# Altium schematic sheet UsbGameController.SchDoc
size OrCAD A
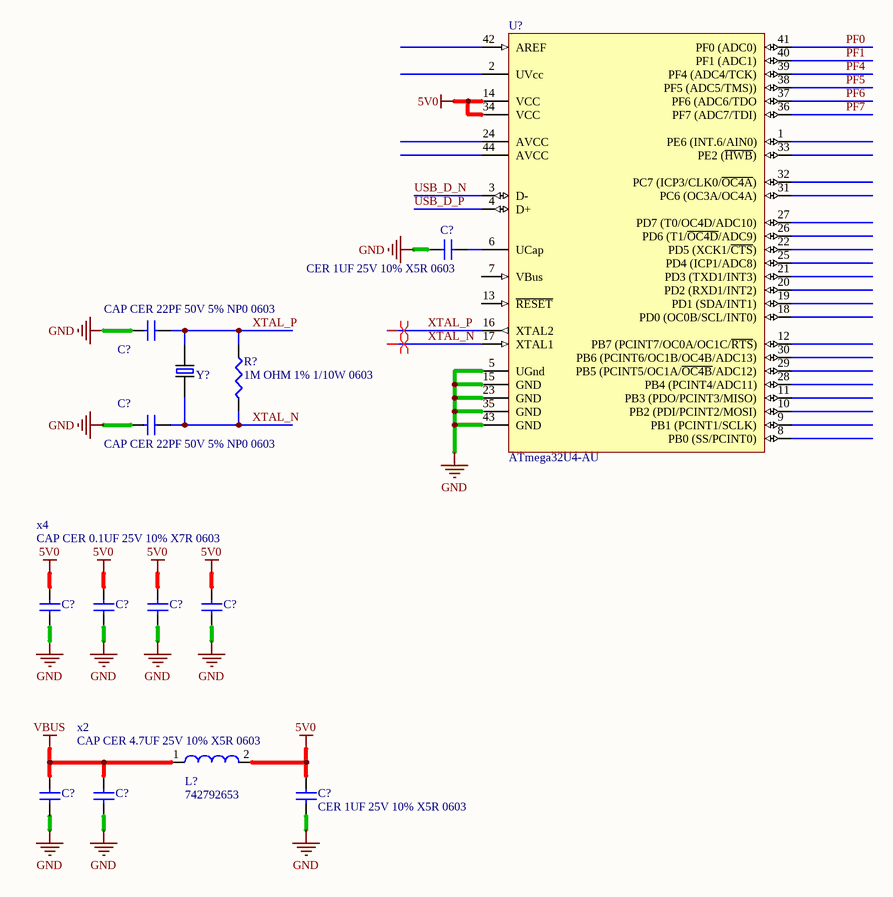
[diagram p0: UsbGameController.SchDoc]

## Parts
(Parts that share a designator on the sheet are numbered #1, #2 ... from top to bottom, then left to right.)
C?#1  CER 1UF 25V 10% X5R 0603  [C0603]
C?#2  CAP CER 22PF 50V 5% NP0 0603  [C0603]
C?#3  CAP CER 22PF 50V 5% NP0 0603  [C0603]
C?#4  CAP CER 0.1UF 25V 10% X7R 0603  [C0603]
C?#5  CAP CER 0.1UF 25V 10% X7R 0603  [C0603]  (value not drawn)
C?#6  CAP CER 0.1UF 25V 10% X7R 0603  [C0603]  (value not drawn)
C?#7  CAP CER 0.1UF 25V 10% X7R 0603  [C0603]  (value not drawn)
C?#8  CAP CER 4.7UF 25V 10% X5R 0603  [C0603]
C?#9  CAP CER 4.7UF 25V 10% X5R 0603  [C0603]  (value not drawn)
C?#10  CER 1UF 25V 10% X5R 0603  [C0603]
L?  742792653  [SMD-0603]
R?  1M OHM 1% 1/10W 0603  [R0603]
U?  ATmega32U4-AU  [44ML_N]
Y?  CRYSTAL 16.0000MHZ 10PF SMD  [4-SMD]  (value not drawn)

## Nets
5V0: C?#4.1 C?#5.1 C?#6.1 C?#7.1 C?#10.1 L?.2 U?.14(VCC) U?.34(VCC)
GND: C?#1.2 C?#2.1 C?#3.1 C?#4.2 C?#5.2 C?#6.2 C?#7.2 C?#8.2 C?#9.2 C?#10.2 U?.5(UGnd) U?.15(GND) U?.23(GND) U?.35(GND) U?.43(GND)
VBUS: C?#8.1 C?#9.1 L?.1
PF0: U?.41(PF0_(ADC0))
PF1: U?.40(PF1_(ADC1))
PF4: U?.39(PF4_(ADC4/TCK))
PF5: U?.38(PF5_(ADC5/TMS)))
PF6: U?.37(PF6_(ADC6/TDO)
PF7: U?.36(PF7_(ADC7/TDI))
USB_D_N: U?.3(D-)
USB_D_P: U?.4(D+)
XTAL_N: C?#3.2 R?.1 U?.17(XTAL1) Y?.+
XTAL_P: C?#2.2 R?.2 U?.16(XTAL2) Y?.-
NetC?#1_1: C?#1.1 U?.6(UCap)

Not connected (* = marked no-connect by the designer): U? 1(PE6_(INT.6/AIN0)) 2(UVcc) 7(VBus) 8(PB0_(SS/PCINT0)) 9(PB1_(PCINT1/SCLK)) 10(PB2_(PDI/PCINT2/MOSI)) 11(PB3_(PDO/PCINT3/MISO)) 12(PB7_(PCINT7/OC0A/OC1C/~{RTS})) 13(~{RESET}) 18(PD0_(OC0B/SCL/INT0)) 19(PD1_(SDA/INT1)) 20(PD2_(RXD1/INT2)) 21(PD3_(TXD1/INT3)) 22(PD5_(XCK1/~{CTS})) 24(AVCC) 25(PD4_(ICP1/ADC8)) 26(PD6_(T1/~{OC4D}/ADC9)) 27(PD7_(T0/OC4D/ADC10)) 28(PB4_(PCINT4/ADC11)) 29(PB5_(PCINT5/OC1A/~{OC4B}/ADC12)) 30(PB6_(PCINT6/OC1B/OC4B/ADC13)) 31(PC6_(OC3A/OC4A)) 32(PC7_(ICP3/CLK0/~{OC4A})) 33(PE2_(~{HWB})) 42(AREF) 44(AVCC)

## Layout directives
differential pair: XTAL_N, XTAL_P

## Notes on the sheet
- x4
- x2

## Library data of the parts
C?#1 C?#10 = GRM185R61E105KA12D: CAP CER 1UF 25V 10% X5R 0603; Manufacturer: Murata; Manufacturer Part Number: GRM185R61E105KA12D; Value: 1uF; Tolerance: 10%
C?#2 C?#3 = GRM1885C1H220JA01D: Manufacturer: Murata; Tolerance: 10%; Manufacturer Part Number: GRM1885C1H220JA01D; Value: 22pF
C?#4-C?#7 = GRM188R71E104KA01D: Manufacturer: Murata; Manufacturer Part Number: GRM188R71E104KA01D; Value: 0.1uF; Tolerance: 10%
C?#8 C?#9 = GRM188R61E475KE11D: Manufacturer: Murata; Manufacturer Part Number: GRM188R61E475KE11D; Value: 4.7uF; Tolerance: 10%
L? = 742792653: SMD EMI Suppression Ferrite Bead WE-CBF, Z = 600 Ohm; Impedance: 600 Ohm; DatasheetVersion: Dec-2005; PackageVersion: 2009; PackageReference: SMD-0603; PackageDescription: Chip Inductor, 2-Leads, Body 1.6 x 0.8 mm; ComponentLink1Description: Manufacturer URL; ComponentLink1URL: http://www.we-online.com; ComponentLink2Description: Datasheet; ComponentLink2URL: http://www.we-online.de/katalog/media/pdf/742792653.pdf
R? = CRCW06031M00FKEA: RES SMD 1M OHM 1% 1/10W 0603; Manufacturer: Vishay; Power Rating: 0.1 W; Manufacturer Part Number: CRCW06031M00FKEA; Tolerance: 1%; Package: R0603; Value: 1M
U? = ATmega32U4-AU: 8-bit AVR Microcontroller, 2.7-5.5V, 16MHz, 32KB Flash, 1KB EEPROM, 2.5KB SRAM, USB Controller, 44-pin TQFP, Industrial Grade (-40°C to 85°C), Ext Osc; DatasheetVersion: revF, Nov-2010; PackageVersion: rev.G, Jul-2007; PackageReference: 44ML; PackageDescription: 44-Pin Plastic Thin Quad Flat Pack, 10 x 10 x 1.0 mm Body, 0.8 mm Pitch (TQFP); ComponentLink1Description: Manufacturer URL; ComponentLink1URL: http://www.atmel.com/; ComponentLink2Description: ATmega16U4/32U4 Datasheet; ComponentLink2URL: http://www.atmel.com/dyn/resources/prod_documents/doc7766.pdf; ComponentLink3Description: ATmega16U4 ATmega32U4 Summary; ComponentLink3URL: http://www.atmel.com/dyn/resources/prod_documents/7766S.pdf
Y? = ABM8G-16.000MHZ-4Y-T3: Manufacturer: Abracon LLC; Tolerance: +/- 30ppm; ESR: 80 Ohm; Shunt Capacitance: 5.0pF; Manufacturer Part Number: ABM8G-16.000MHZ-4Y-T3; Value: 16.0000MHz; Load Capacitance: 10pF; Stability: +/- 30ppm